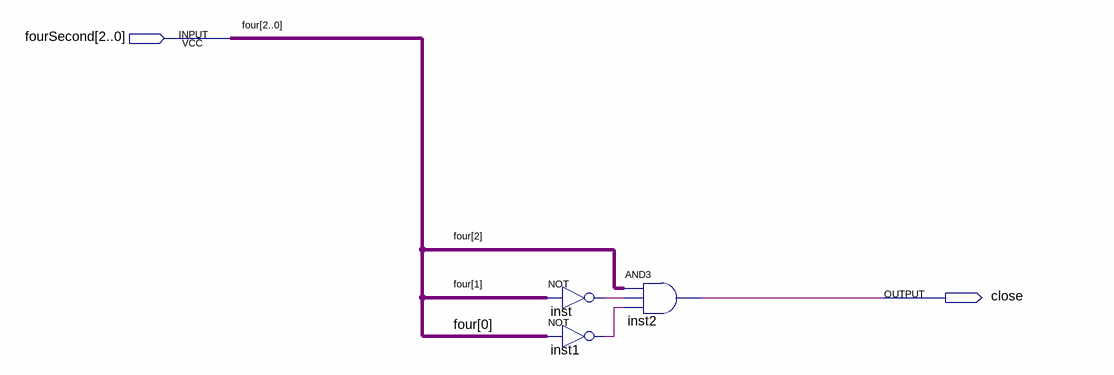
[diagram p0: schematic sheet]
// Quartus schematic fourSecond.bdf as structural Verilog: 3 symbols, 2 pins
module fourSecond (
  input  [2:0] fourSecond,
  output close
);

  wire inst1_out, inst_out;

  not inst (inst_out, fourSecond[1]);
  not inst1 (inst1_out, fourSecond[0]);
  and inst2 (close, fourSecond[2], inst_out, inst1_out);

  // Other names for the same wires on the sheet: four[2:0] = fourSecond
endmodule
